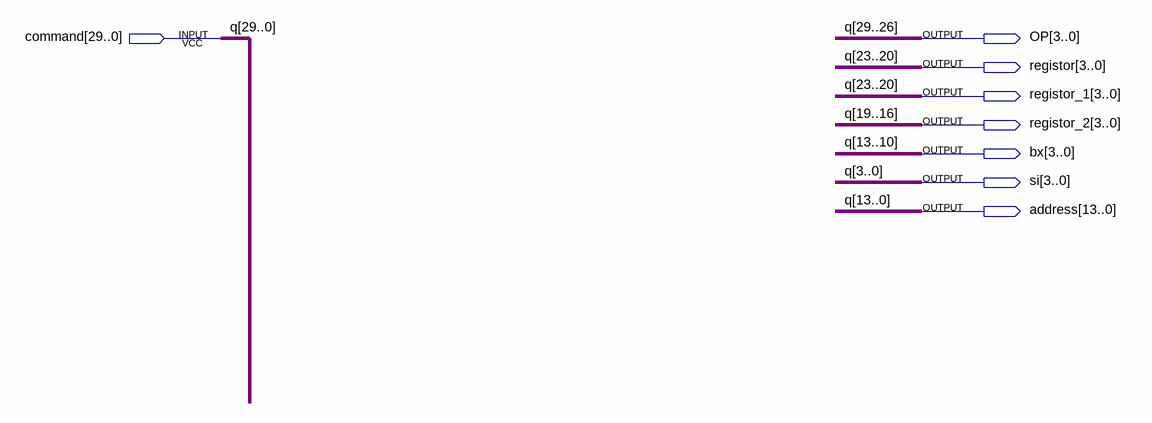
[diagram p0: schematic sheet]
// Quartus schematic ID.bdf as structural Verilog: 0 symbols, 8 pins
module ID (
  input  [29:0] command,
  output [3:0] OP,
  output [3:0] registor,
  output [3:0] registor_1,
  output [3:0] registor_2,
  output [3:0] bx,
  output [3:0] si,
  output [13:0] address
);


  assign address = command[13:0];
  assign bx = command[13:10];
  assign OP = command[29:26];
  assign registor = command[23:20];
  assign registor_1 = command[23:20];
  assign registor_2 = command[19:16];
  assign si = command[3:0];

  // Other names for the same wires on the sheet: q[29:0] = command
endmodule
